# EAGLE design ChargerTimer_V4 (EAGLE 6.4)
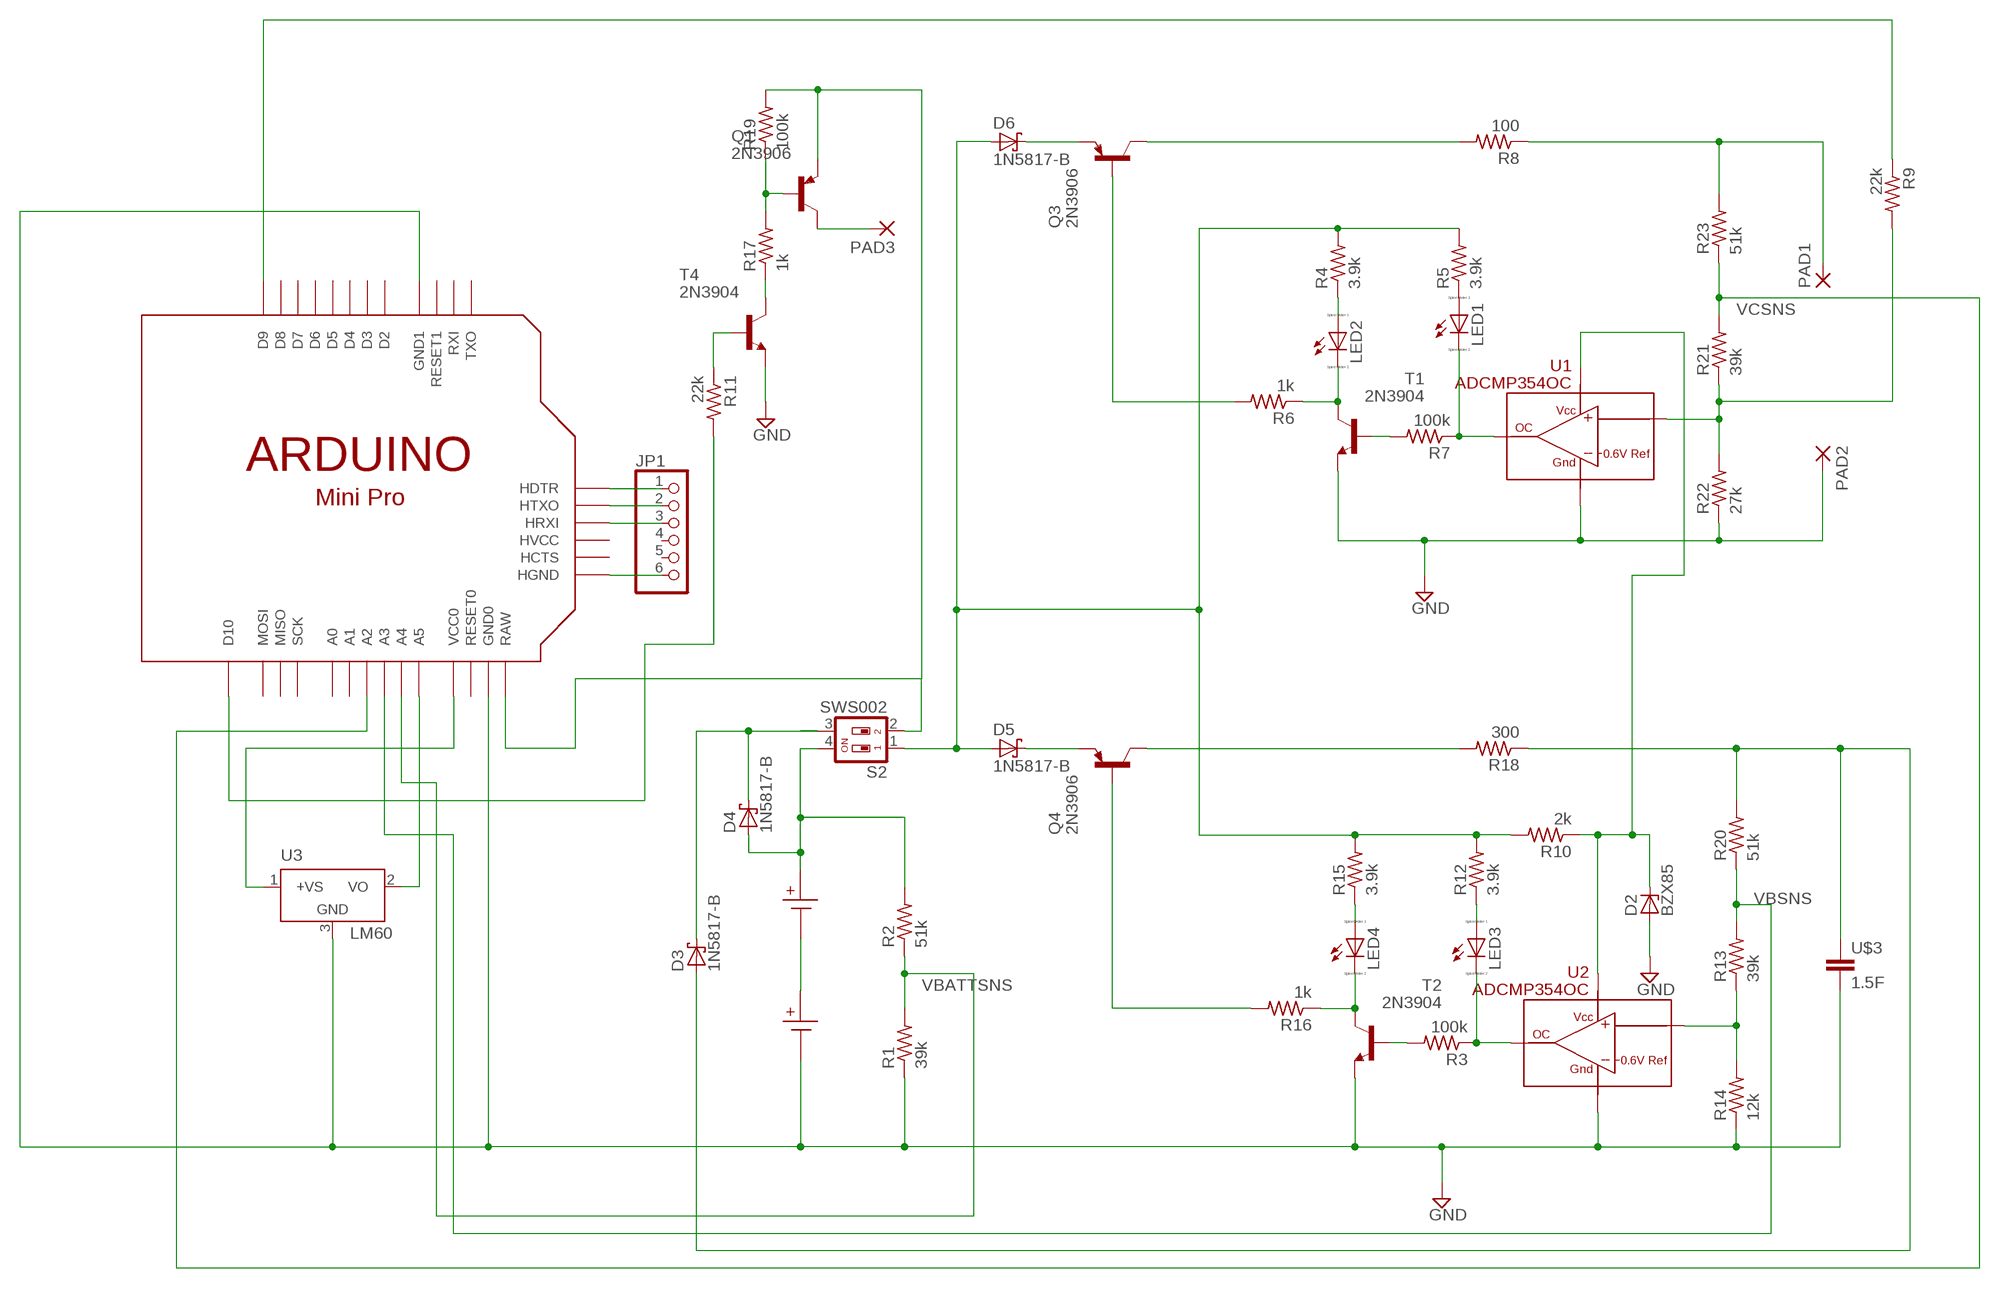
[diagram p0: schematic, sheet 1]

## Parts
D2  BZX85  [DO41Z10]
D3  1N5817-B  [DO41-7.6]
D4  1N5817-B  [DO41-7.6]
D5  1N5817-B  [DO41-7.6]
D6  1N5817-B  [DO41-7.6]
JP1  PINHD-1X6  [1X06]
LED1  LED_ELD260  [LED_LD260]
LED2  LED_ELD260  [LED_LD260]
LED3  LED_ELD260  [LED_LD260]
LED4  LED_ELD260  [LED_LD260]
PAD1  2,15/1,0  [2,15/1,0]
PAD2  2,15/1,0  [2,15/1,0]
PAD3  2,15/1,0  [2,15/1,0]
Q1  2N3906  [TO92]
Q3  2N3906  [TO92]
Q4  2N3906  [TO92]
R1  39k  R-US_0207/7  [0207/7]
R2  51k  R-US_0207/7  [0207/7]
R3  100k  R-US_0207/7  [0207/7]
R4  3.9k  R-US_0207/7  [0207/7]
R5  3.9k  R-US_0207/7  [0207/7]
R6  1k  R-US_0207/7  [0207/7]
R7  100k  R-US_0207/7  [0207/7]
R8  100  R-US_0207/7  [0207/7]
R9  22k  R-US_0207/7  [0207/7]
R10  2k  R-US_0207/7  [0207/7]
R11  22k  R-US_0207/7  [0207/7]
R12  3.9k  R-US_0207/7  [0207/7]
R13  39k  R-US_0207/7  [0207/7]
R14  12k  R-US_0207/7  [0207/7]
R15  3.9k  R-US_0207/7  [0207/7]
R16  1k  R-US_0207/7  [0207/7]
R17  1k  R-US_0207/7  [0207/7]
R18  300  R-US_0207/7  [0207/7]
R19  100k  R-US_0207/7  [0207/7]
R20  51k  R-US_0207/7  [0207/7]
R21  39k  R-US_0207/7  [0207/7]
R22  27k  R-US_0207/7  [0207/7]
R23  51k  R-US_0207/7  [0207/7]
S2  SWS002  [SMS-002]
T1  2N3904  [TO92]
T2  2N3904  [TO92]
T4  2N3904  [TO92]
U1  ADCMP354OC  [ADCMP35X]
U2  ADCMP354OC  [ADCMP35X]
U3  LM60  [TO92]
U$1  BH1000G  [BH1000G]
U$2  BH1000G  [BH1000G]
U$3  1.5F  C1000X850  [SUPERCAP1.0/0.85H]
U$4  ARDUINOMINI  [ARDUINOMINI]

## Nets
GND: D2.A PAD2.1(P) R1.1 R14.1 R22.1 T1.3(E) T2.3(E) T4.3(E) U1.P2(GND) U2.P2(GND) U3.3(GND) U$2.NEG$2(P2) U$3.P$2 U$4.P$9(GND1) U$4.P$20(GND0)
N$1: U1.P1(IN)
N$2: Q3.1(C) R8.2
N$3: LED1.K(C) R7.1 U1.P3(OUT)
N$4: LED1.A R5.1
N$5: LED2.A R4.1
N$6: LED2.K(C) R6.1 T1.1(C)
N$7: Q3.2(B) R6.2
N$8: R9.1 U$4.P$1(D9)
N$9: R3.2 T2.2(B)
N$10: D3.A R18.1 R20.2 U$3.P$1
N$11: D3.C D4.C S2.3
N$12: U$1.NEG$2(P2) U$2.POS$1(P1)
N$13: R7.2 T1.2(B)
N$14: D6.C Q3.3(E)
N$15: D2.C R10.1 U1.P4(VCC) U2.P4(VCC)
N$16: R13.1 R14.2 U2.P1(IN)
N$17: LED3.K(C) R3.1 U2.P3(OUT)
N$18: LED3.A R12.1
N$19: LED4.A R15.1
N$20: LED4.K(C) R16.1 T2.1(C)
N$21: R17.1 T4.1(C)
N$22: Q1.2(B) R17.2 R19.1
N$23: Q4.2(B) R16.2
N$24: PAD3.1(P) Q1.1(C)
N$25: U3.2(VO) U$4.P$35(A5)
N$26: R11.2 U$4.P$30(D10)
N$27: Q4.1(C) R18.2
N$28: D5.C Q4.3(E)
N$29: JP1.1 U$4.P$13(HDTR)
N$30: U3.1(+VS) U$4.P$22(VCC0)
N$31: R11.1 T4.2(B)
N$32: JP1.2 U$4.P$14(HTXO)
N$34: R9.2 R21.1 R22.2
N$36: D5.A D6.A R4.2 R5.2 R10.2 R12.2 R15.2 S2.1
N$38: D4.A R2.2 S2.4 U$1.POS$1(P1)
N$39: JP1.3 U$4.P$15(HRXI)
N$40: JP1.6 U$4.P$18(HGND)
N$41: PAD1.1(P) R8.1 R23.2
N$42: Q1.3(E) R19.2 S2.2 U$4.P$19(RAW)
VBATTSNS: R1.2 R2.1 U$4.P$34(A4)
VBSNS: R13.2 R20.1 U$4.P$23(A3)
VCSNS: R21.2 R23.1 U$4.P$24(A2)
Unconnected: JP1.4 JP1.5 U$4.P$2(D8) U$4.P$3(D7) U$4.P$4(D6) U$4.P$5(D5) U$4.P$6(D4) U$4.P$7(D3) U$4.P$8(D2) U$4.P$10(RESET1) U$4.P$11(RXI) U$4.P$12(TXO) U$4.P$16(HVCC) U$4.P$17(HCTS) U$4.P$21(RESET0) U$4.P$25(A1) U$4.P$26(A0) U$4.P$27(SCK) U$4.P$28(MISO) U$4.P$29(MOSI)

## Library data of the parts
D2 = diode:BZX85: Z DIODE
D3-D6 = diode:1N581*: 1.0A SCHOTTKY BARRIER RECTIFIER Source: http://www.diodes.com/datasheets/ds23001.pdf
JP1 = adafruit:PINHD-1X6: PIN HEADER
LED1-LED4 = eagle-ltspice:LED_E: LED Source: http://www.osram.convergy.de Source: www.luxeon.com Source: www.kingbright.com; SPICEMODEL: NONE; SPICEPREFIX: D; SPICETYPE: diode
PAD1-PAD3 = wirepad:2,15/1,0: THROUGH-HOLE PAD
Q1 Q3 Q4 = transistor-pnp:2N3906: PNP Transistor
R1-R23 = rcl:R-US_: RESISTOR, American symbol
S2 = smd-special:SWS002: SMD Dip Switch 2 pol.
T1 T2 T4 = transistor:2N3904: NPN TRANSISTOR
U1 U2 = mydevices:ADCMP354OC
U3 = mydevices:LM60
U$1 U$2 = mymechanical:BH1000G: CR2477 Battery vertical holder
U$3 = mypassives:C1000X850
U$4 = adafruit:ARDUINOMINI

## Board
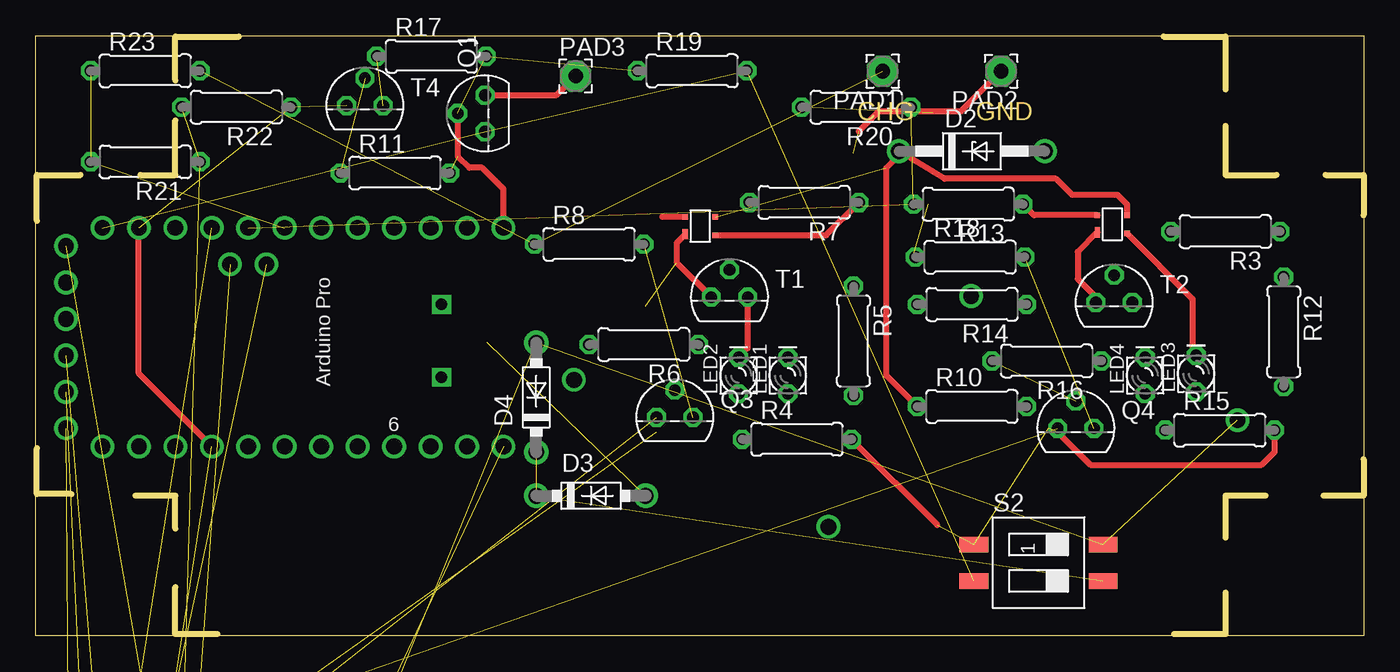
[diagram p1: board, top side]
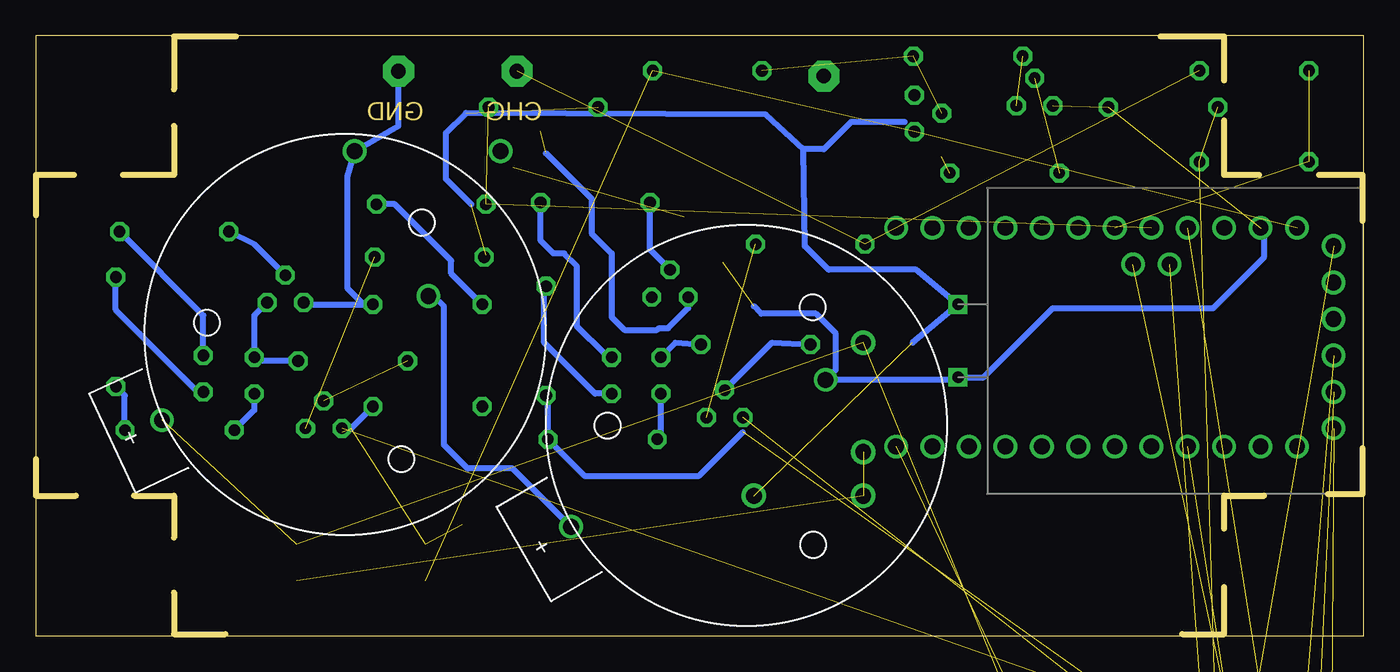
[diagram p2: board, bottom side, seen from below]

Size 92.5 x 41.8 mm. Coordinates in mm from the lower left corner, seen from the top.
Outline: 0,0 0,41.8 92.5,41.8 92.5,0 0,0
Copper layers (1*16): Top 0.035mm / dielectric 1.5mm / Bottom 0.035mm
Design rules "FarHorizonsMill": minimum track width 15mil, minimum drill 23mil, track to track 15mil, track to pad 15mil, pad to pad 15mil, via to via 15mil, smd to smd 8mil, copper to edge 40mil, drill to drill 20mil, minimum pad ring 10mil, minimum via ring 8mil, stop-mask expansion 4mil, vias tented up to drill 0mil, thermal gap 20mil
Milling: 24 lines

### Footprints (pad centres in the part's own frame; a part is rotated, then mirrored left to right if it is on the bottom)
DO41Z10 = drill 1.118: A 5.08,0; C -5.08,0
DO41-7.6 = drill 1.1 pad 1.7: A 3.81,0; C -3.81,0
1X06 = drill 1.016 octagon: 1 -6.35,0; 2 -3.81,0; 3 -1.27,0; 4 1.27,0; 5 3.81,0; 6 6.35,0
LED_LD260 = drill 0.813 octagon: A -1.27,0; K 1.27,0
2,15/1,0 = drill 1.016 pad 2.159 octagon: 1 0,0
TO92 = drill 0.813 octagon: 1 1.27,0; 2 0,1.905; 3 -1.27,0
0207/7 = drill 0.813 octagon: 1 -3.81,0; 2 3.81,0
SMS-002 = smd 1.092 x 2.007: 1 -1.27,-4.496; 2 1.27,-4.496; 3 1.27,4.496; 4 -1.27,4.496
ADCMP35X = smd 0.381 x 0.381: P1 -0.635,-1.041; P3 0.635,1.041; P4 -0.635,1.041 | smd 0.711 x 0.381: P2 0.559,-1.041
TO92' = drill 0.813 pad 1.676 octagon: 1 -1.27,0; 2 0,1.905; 3 1.27,0
BH1000G = drill 1.1: NEG$2 0,-6.502; POS$1 0,13.97
SUPERCAP1.0/0.85H = drill 0.8 square: P$1 -2.54,-14.732; P$2 2.54,-14.732
ARDUINOMINI = drill 1.1: P$1 -7.62,-13.97; P$2 -7.62,-11.43; P$3 -7.62,-8.89; P$4 -7.62,-6.35; P$5 -7.62,-3.81; P$6 -7.62,-1.27; P$7 -7.62,3.81; P$8 -7.62,1.27; P$9 -7.62,6.35; P$10 -7.62,8.89; P$11 -7.62,11.43; P$12 -7.62,13.97; P$13 -6.35,16.51; P$14 -3.81,16.51; P$15 -1.27,16.51; P$16 1.27,16.51; P$17 3.81,16.51; P$18 6.35,16.51; P$19 7.62,13.97; P$20 7.62,11.43; P$21 7.62,8.89; P$22 7.62,6.35; P$23 7.62,3.81; P$24 7.62,1.27; P$25 7.62,-1.27; P$26 7.62,-3.81; P$27 7.62,-6.35; P$28 7.62,-8.89; P$29 7.62,-11.43; P$30 7.62,-13.97; P$34 5.08,5.08; P$35 5.08,2.54

### Placement (x,y rotation side)
D2  65.21,33.75 0 top
D3  38.67,9.75 0 top
D4  34.86,16.61 90 top
D5  5.08,-10.16 0 top  (outside the outline)
D6  5.08,-17.78 0 top  (outside the outline)
JP1  8.89,-48.26 0 top  (outside the outline)
LED1  52.39,18.13 90 top
LED2  48.96,18.13 90 top
LED3  80.83,18.26 90 top
LED4  77.28,18.13 90 top
PAD1  58.99,39.34 180 top
PAD2  67.25,39.34 180 top
PAD3  37.6,39 0 top
Q1  31.3,36.4 90 top
Q3  44.51,15.21 0 top
Q4  72.45,14.45 0 top
R1  5.08,-38.1 0 top  (outside the outline)
R2  5.08,-43.18 0 top  (outside the outline)
R3  82.87,28.16 180 top
R4  53.02,13.69 0 top
R5  56.96,20.54 270 top
R6  42.35,20.29 180 top
R7  53.53,30.2 180 top
R8  38.54,27.27 0 top
R9  5.08,-53.34 0 top  (outside the outline)
R10  65.21,15.97 0 top
R11  25.02,32.25 0 top
R12  86.93,21.18 270 top
R13  64.96,30.07 180 top
R14  65.21,23.08 180 top
R15  82.48,14.32 0 top
R16  70.42,19.15 180 top
R17  27.56,40.38 0 top
R18  65.09,26.39 0 top
R19  45.72,39.37 0 top
R20  57.15,36.83 180 top
R21  7.62,33.02 180 top
R22  13.97,36.83 180 top
R23  7.62,39.37 0 top
S2  69.85,5.08 270 top
T1  48.32,23.59 0 top
T2  75.12,23.21 0 top
T4  22.92,36.94 0 top
U1  46.29,28.55 270 top
U2  74.99,28.67 270 top
U3  LM60  [TO92']  3.81,-33.02 0 top  (outside the outline)
U$1  71.06,20.93 115 bottom
U$2  43.12,14.57 120 bottom
U$3  13.52,20.54 270 bottom
U$4  18.6,20.8 90 top

### Tracks (layer width: path | path; a pad name or v marks a point on that pad's centre or on a via)
GND  (6 unrouted)
  Top 0.406: U2.P2 72.58,26.74 72.58,24.86 73.85,23.59 T2.3 | U$4.P$9 7.17,18.26 U$4.P$20 | U1.P2 44.64,27.38 44.64,26 T1.3 | 57.34,35.15 58.74,36.55 64.45,36.55 PAD2.1
  Bottom 0.406: T2.3 73.72,23.08 R14.1 69.66,23.08 70.8,24.23 70.8,31.97 D2.A 67.25,35.53 PAD2.1 | U$4.P$20 6.92,28.16 6.92,26.39 10.48,22.83 21.65,22.83 26.48,18 U$3.P$2 28.94,17.83 U$2.NEG$2 36.77,18.55 36.77,21.05 38.16,22.45 41.97,22.45 42.48,22.96 | 56.96,33.62 53.78,30.45 53.78,28.04 52.39,26.64 52.39,22.2 51.5,21.31 49.21,21.31 49.08,21.43 48.45,21.43 47.05,22.83 T1.3
N$1
  Top 0.406: U1.P1 43.62,29.18
N$2  (1 unrouted)
N$3
  Top 0.406: U1.P3 55.05,27.91 R7.1
  Bottom 0.406: LED1.K 52.39,19.53 52.51,19.66 52.89,19.66 54.8,21.56 54.8,25.75 55.69,26.64 56.45,26.64 57.34,27.53 R7.1
N$4
  Bottom 0.406: LED1.A 53.53,16.86 57.09,20.42 57.09,24.23 R5.1
N$5
  Bottom 0.406: R4.1 48.96,13.94 LED2.A
N$6
  Top 0.406: T1.1 49.59,20.04 LED2.K
  Bottom 0.406: LED2.K 47.94,20.42 R6.1
N$7
  Bottom 0.406: Q3.2 41.21,20.42 R6.2
N$8  (1 unrouted)
N$9
  Bottom 0.406: T2.2 77.28,27.27 R3.2
N$10  (3 unrouted)
  Bottom 0.406: R18.1 61.15,26.51 | 39.02,33.9 38.92,27.15 37.27,25.5 31.18,25.5 U$3.P$1 31.43,20.42 | 39.02,33.9 41.65,36.32 62.55,36.42 63.94,35.02 63.94,31.85 62.16,30.07 | 31.97,35.8 35.7,35.8 37.6,33.9 39.02,33.9
N$11  (2 unrouted)
N$12
  Bottom 0.406: U$1.NEG$2 64.79,23.67 64.07,22.96 64.07,13.3 62.42,11.65 59.28,11.65 U$2.POS$1
N$13
  Bottom 0.406: T1.2 49.72,26.89 R7.2
N$14  (1 unrouted)
N$15  (1 unrouted)
  Top 0.406: R10.1 59.24,18.13 59.24,32.61 60.39,33.75 D2.C 63.31,31.85 71.06,31.85 72.2,30.7 75.37,30.7 76.03,30.04 U2.P4
N$16
  Top 0.406: U2.P1 69.53,29.31 R13.1
  Bottom 0.406: R14.2 63.56,25.24 63.56,26.13 67.5,30.07 R13.1
N$17
  Top 0.406: U2.P3 76.03,28.01 80.58,23.46 80.58,19.78 LED3.K
  Bottom 0.406: LED3.K 80.83,22.32 R3.1
N$18
  Bottom 0.406: LED3.A 81.22,16.99 86.93,22.7 R12.1
N$19
  Bottom 0.406: LED4.A 77.28,15.72 R15.1
N$20
  Bottom 0.406: T2.1 77.28,22.32 LED4.K 77.02,19.15 R16.1
N$21  (1 unrouted)
N$22  (2 unrouted)
N$23  (1 unrouted)
N$24
  Top 0.406: Q1.1 36.27,37.67 PAD3.1
N$25  (1 unrouted)
N$26  (1 unrouted)
  Top 0.406: U$4.P$30 32.57,31.13 31.1,32.6 30.2,32.6 29.4,33.4 29.4,36.4
N$27  (1 unrouted)
N$28  (1 unrouted)
N$29  (1 unrouted)
N$30  (1 unrouted)
N$31  (1 unrouted)
N$32  (1 unrouted)
N$34  (2 unrouted)
N$36  (5 unrouted)
  Top 0.406: R4.2 62.8,7.72 | 71.18,14.19 73.47,11.91 85.41,11.91 86.3,12.8 R15.2
  Bottom 0.406: R5.2 56.83,16.61 R4.2 54.29,11.15 46.29,11.15 43.24,14.19 | 70.55,14.45 R10.2 | R15.2 86.3,16.73 R12.2
N$38  (3 unrouted)
N$39  (1 unrouted)
N$40  (1 unrouted)
N$41  (2 unrouted)
N$42  (3 unrouted)
VBATTSNS  (2 unrouted)
VBSNS  (2 unrouted)
VCSNS  (2 unrouted)

### Text on the board
Milling: CHG | GND